# EAGLE design common_board_th (EAGLE 6.5.0)
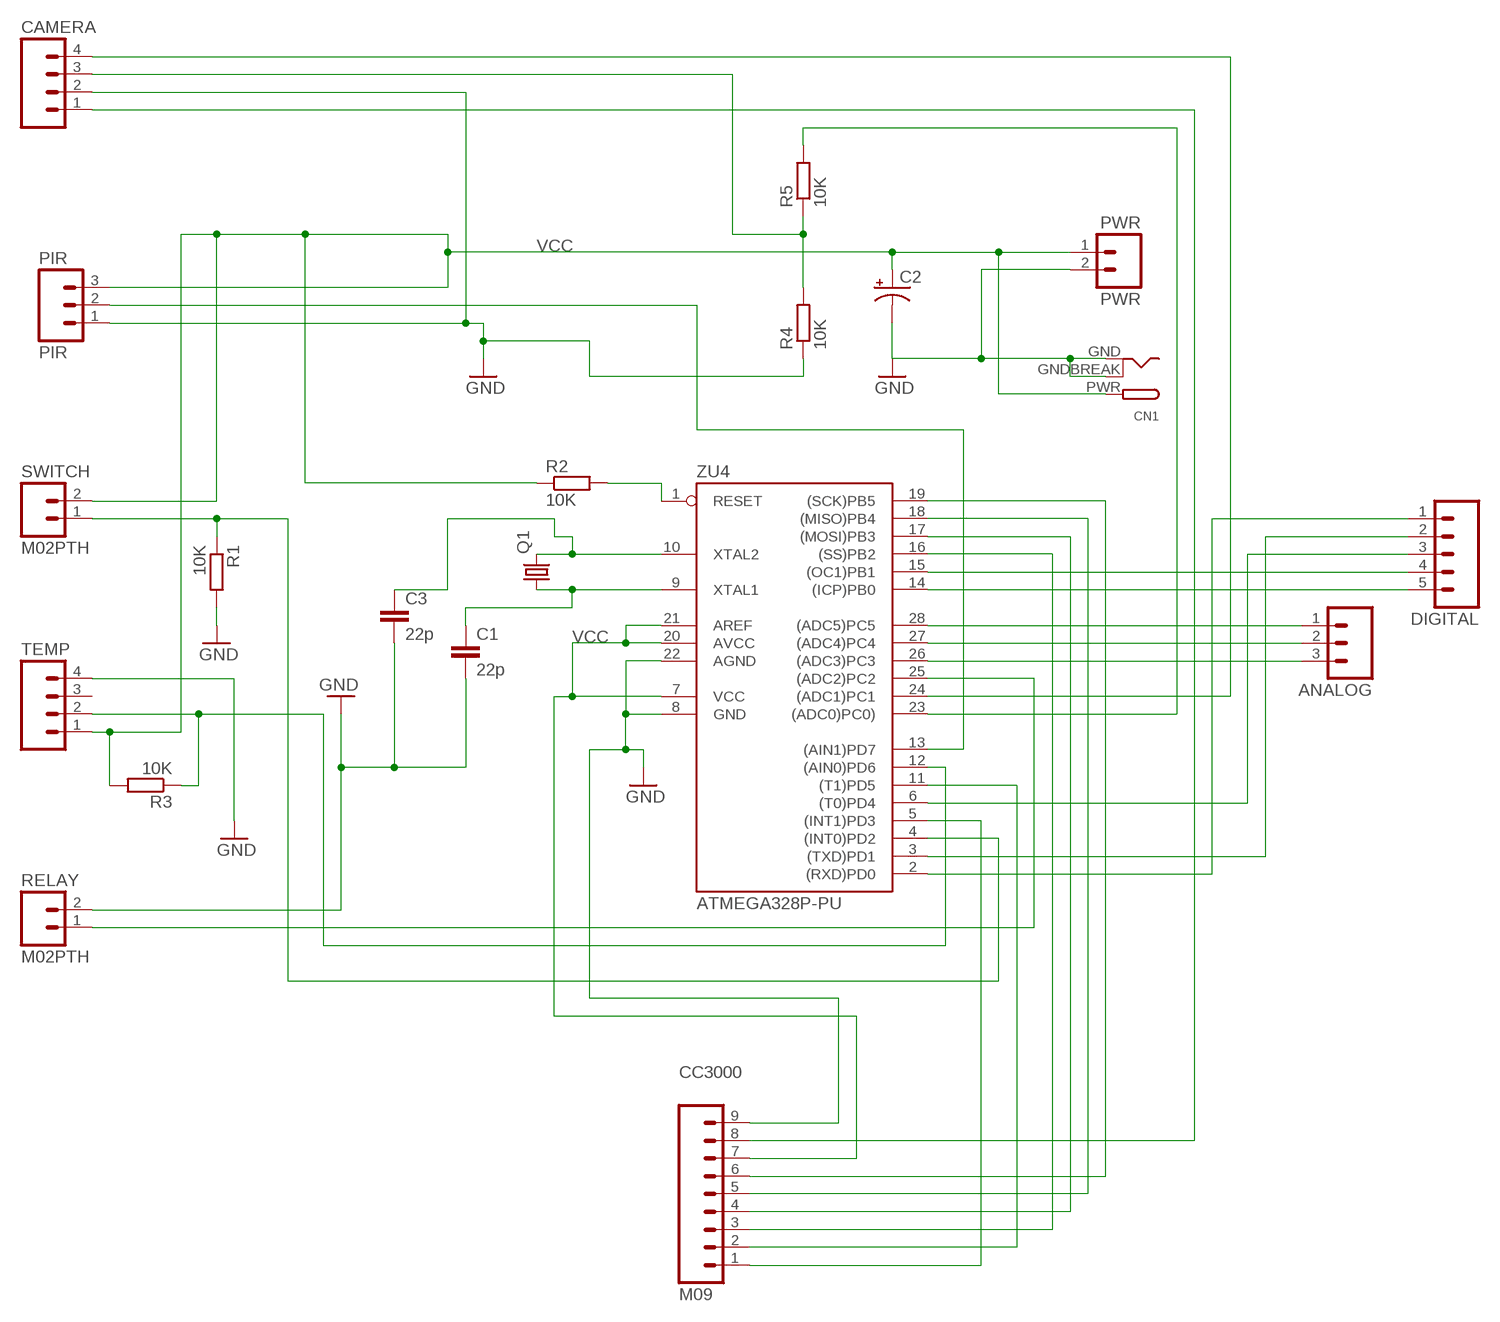
[diagram p0: schematic, sheet 1]

## Parts
ANALOG  M03PTH  [1X03]
C1  22p  C-EU050-025X075  [C050-025X075]
C2  CAP_POLPTH1  [CPOL-RADIAL-100UF-25V]
C3  22p  C-EU050-025X075  [C050-025X075]
CAMERA  M04PTH  [1X04]
CC3000  M09  [1X09]
CN1  DCBARRELPTH  [DCJACK_2MM_PTH]
DIGITAL  M05PTH  [1X05]
PIR  PIR  M03PTH  [1X03]
PWR  PWR  M02PTH  [1X02]
Q1  CRYSTALHC49S  [HC49/S]
R1  10K  R-EU_0207/7  [0207/7]
R2  10K  R-EU_0207/7  [0207/7]
R3  10K  R-EU_0207/7  [0207/7]
R4  10K  R-EU_0207/7  [0207/7]
R5  10K  R-EU_0207/7  [0207/7]
RELAY  M02PTH  [1X02]
SWITCH  M02PTH  [1X02]
TEMP  M04PTH  [1X04]
ZU4  ATMEGA328P-PU  [DIL28-3]

## Nets
GND [gnd]: C1.2 C2.2(-) C3.2 CAMERA.2 CC3000.9 CN1.GND CN1.GNDBREAK PIR.1 PWR.2 R1.2 R4.1 RELAY.2 TEMP.4 ZU4.8(GND) ZU4.22(AGND)
N$1: CC3000.2 ZU4.11((T1)PD5)
N$2: CC3000.1 ZU4.5((INT1)PD3)
N$3: R2.2 ZU4.1(RESET)
N$4: C1.1 Q1.1 ZU4.9(XTAL1)
N$5: CC3000.6 ZU4.19((SCK)PB5)
N$6: CC3000.3 ZU4.16((SS)PB2)
N$7: R1.1 SWITCH.1 ZU4.4((INT0)PD2)
N$8: RELAY.1 ZU4.25((ADC2)PC2)
N$9: R3.1 TEMP.2 ZU4.12((AIN0)PD6)
N$10: ANALOG.1 ZU4.28((ADC5)PC5)
N$11: CAMERA.1 CC3000.8
N$12: CAMERA.4 ZU4.24((ADC1)PC1)
N$13: CAMERA.3 R4.2 R5.1
N$14: ANALOG.2 ZU4.27((ADC4)PC4)
N$15: R5.2 ZU4.23((ADC0)PC0))
N$16: ANALOG.3 ZU4.26((ADC3)PC3)
N$17: DIGITAL.4 ZU4.15((OC1)PB1)
N$18: DIGITAL.5 ZU4.14((ICP)PB0)
N$19: CC3000.5 ZU4.18((MISO)PB4)
N$20: CC3000.4 ZU4.17((MOSI)PB3)
N$21: DIGITAL.3 ZU4.6((T0)PD4)
N$22: DIGITAL.2 ZU4.3((TXD)PD1)
N$23: DIGITAL.1 ZU4.2((RXD)PD0)
N$26: PIR.2 ZU4.13((AIN1)PD7)
VCC [usbvcc]: C2.1(+) CC3000.7 CN1.PWR PIR.3 PWR.1 R2.1 R3.2 SWITCH.2 TEMP.1 ZU4.7(VCC) ZU4.20(AVCC) ZU4.21(AREF)
XTAL2: C3.1 Q1.2 ZU4.10(XTAL2)
Unconnected: TEMP.3

## Library data of the parts
ANALOG PIR = SparkFun-Connectors:M03: Header 3 Standard 3-pin 0.1" header. Use with straight break away headers (SKU : PRT-00116), right angle break away headers (PRT-00553), swiss pins (PRT-00743), machine pins (PRT-00117), and female headers (PRT-00115). Molex polarized connector foot print use with SKU : PRT-08232 with associated crimp pins and housings.
C1 C3 = resistor:C-EU: CAPACITOR, European symbol
C2 = SparkFun-Passives:CAP_POL: Capacitor Polarized These are standard SMD and PTH capacitors. Normally 10uF, 47uF, and 100uF in electrolytic and tantalum varieties. Always verify the external diameter of the through hole cap, it varies with capacity, voltage, and manufacturer. The EIA devices should be standard.
CAMERA TEMP = SparkFun-Connectors:M04: Header 4 Standard 4-pin 0.1" header. Use with straight break away headers (SKU : PRT-00116), right angle break away headers (PRT-00553), swiss pins (PRT-00743), machine pins (PRT-00117), and female headers (PRT-00115). Molex polarized connector foot print use with SKU : PRT-08231 with associated crimp pins and housings. 1MM SMD Version SKU: PRT-10208
CC3000 = SparkFun-Connectors:M09: Header 9 Standard 9-pin 0.1" header. Use with straight break away headers (SKU : PRT-00116), right angle break away headers (PRT-00553), swiss pins (PRT-00743), machine pins (PRT-00117), and female headers (PRT-00115).
CN1 = adafruit:DCBARREL: 2.0mm DC Barrel Jack DCJACK_2MM_PTH - Through Hole Jack (4UConnector: 05537)
DIGITAL = SparkFun-Connectors:M05: Header 5 Standard 5-pin 0.1" header. Use with straight break away headers (SKU : PRT-00116), right angle break away headers (PRT-00553), swiss pins (PRT-00743), machine pins (PRT-00117), and female headers (PRT-00115). Molex polarized connector foot print use with SKU : PRT-08230 with associated crimp pins and housings.
PWR RELAY SWITCH = SparkFun-Connectors:M02: Standard 2-pin 0.1" header. Use with - straight break away headers ( PRT-00116) - right angle break away headers (PRT-00553) - swiss pins (PRT-00743) - machine pins (PRT-00117) - female headers (PRT-00115) Molex polarized connector foot print use with: PRT-08233 with associated crimp pins and housings. 2.54_SCREWTERM for use with PRT-10571. 3.5mm Screw Terminal footprints for PRT-08084 5mm Screw Terminal footprints for use with PRT-08433
Q1 = crystal:CRYSTAL: CRYSTAL; OC_FARNELL: 1667008; OC_NEWARK: unknown
R1-R5 = resistor:R-EU_: RESISTOR, European symbol
ZU4 = SmartPrj:ATMEGA328P-: MICROCONTROLLER 4 Kbytes FLASH 128 bytes SRAM 256 bytes EEPROM UART 6-channel 10 bit ADC

## Net classes
0 default: width 0.152 mm, clearance 0.152 mm
1 power: width 0.61 mm, drill 0.61 mm, clearance 0.254 mm
2 gnd: width 0.203 mm, drill 0.559 mm, clearance 0.152 mm
3 usbvcc: width 0.203 mm, drill 0.61 mm, clearance 0.152 mm
4 aref: width 0.406 mm, drill 0.61 mm, clearance 0.254 mm

## Board
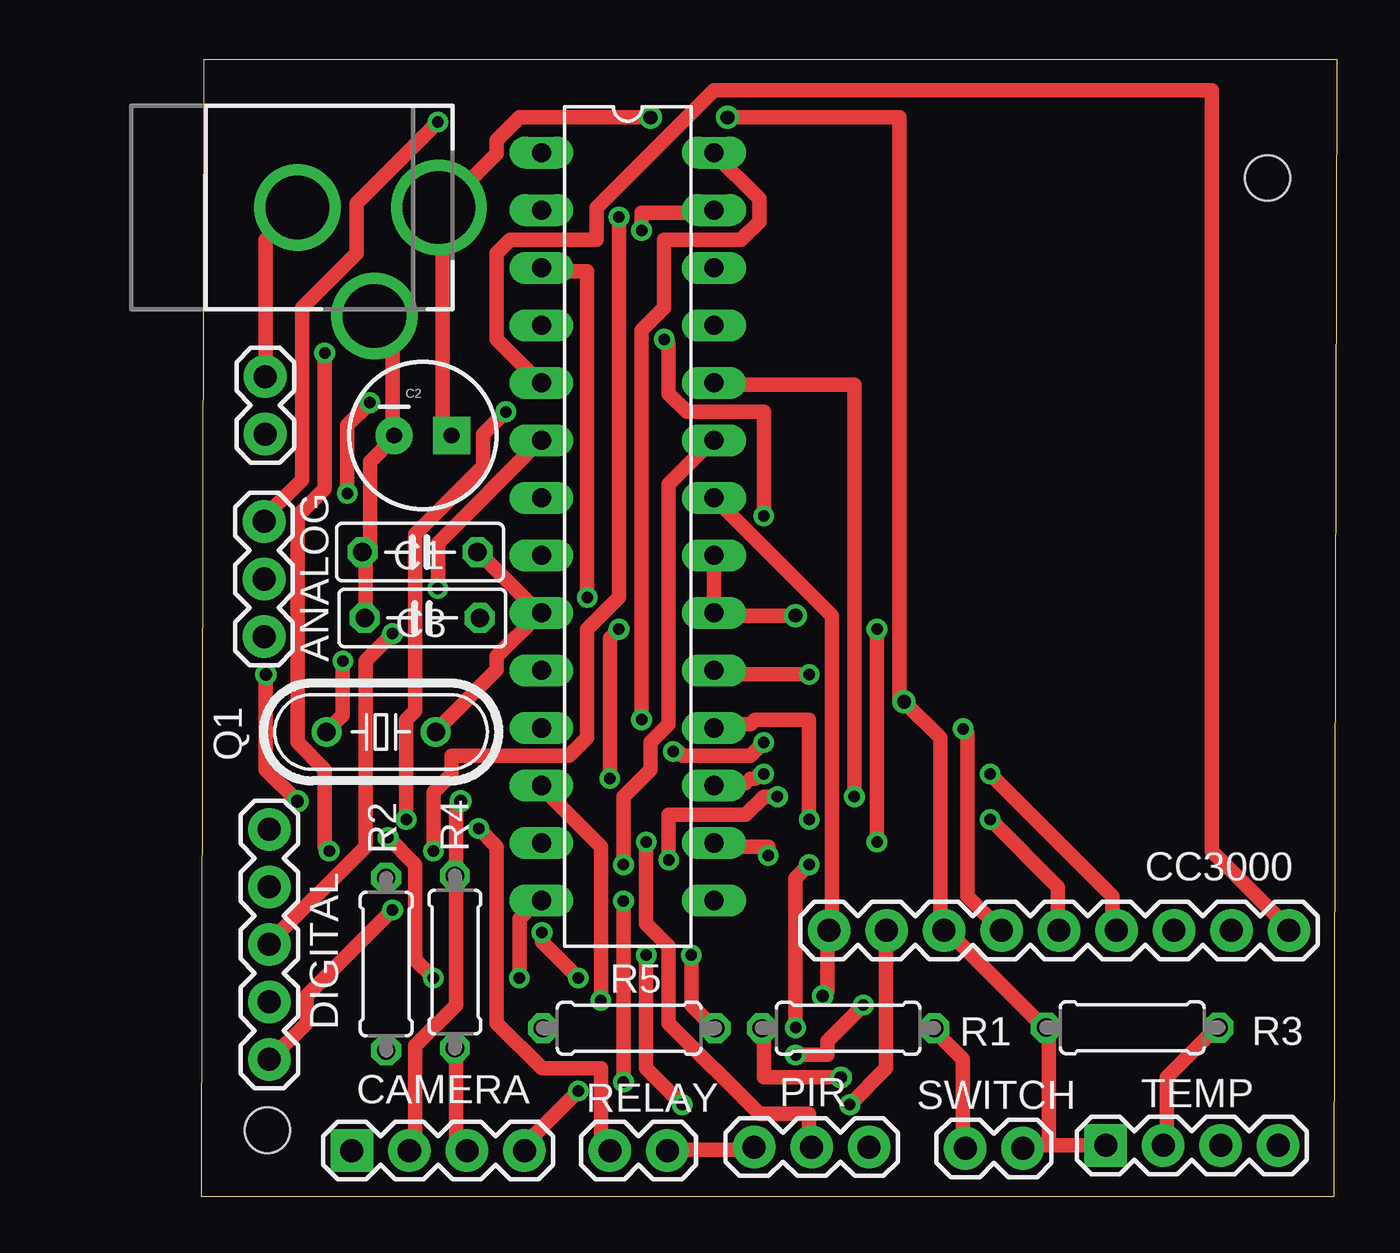
[diagram p1: board, top side]
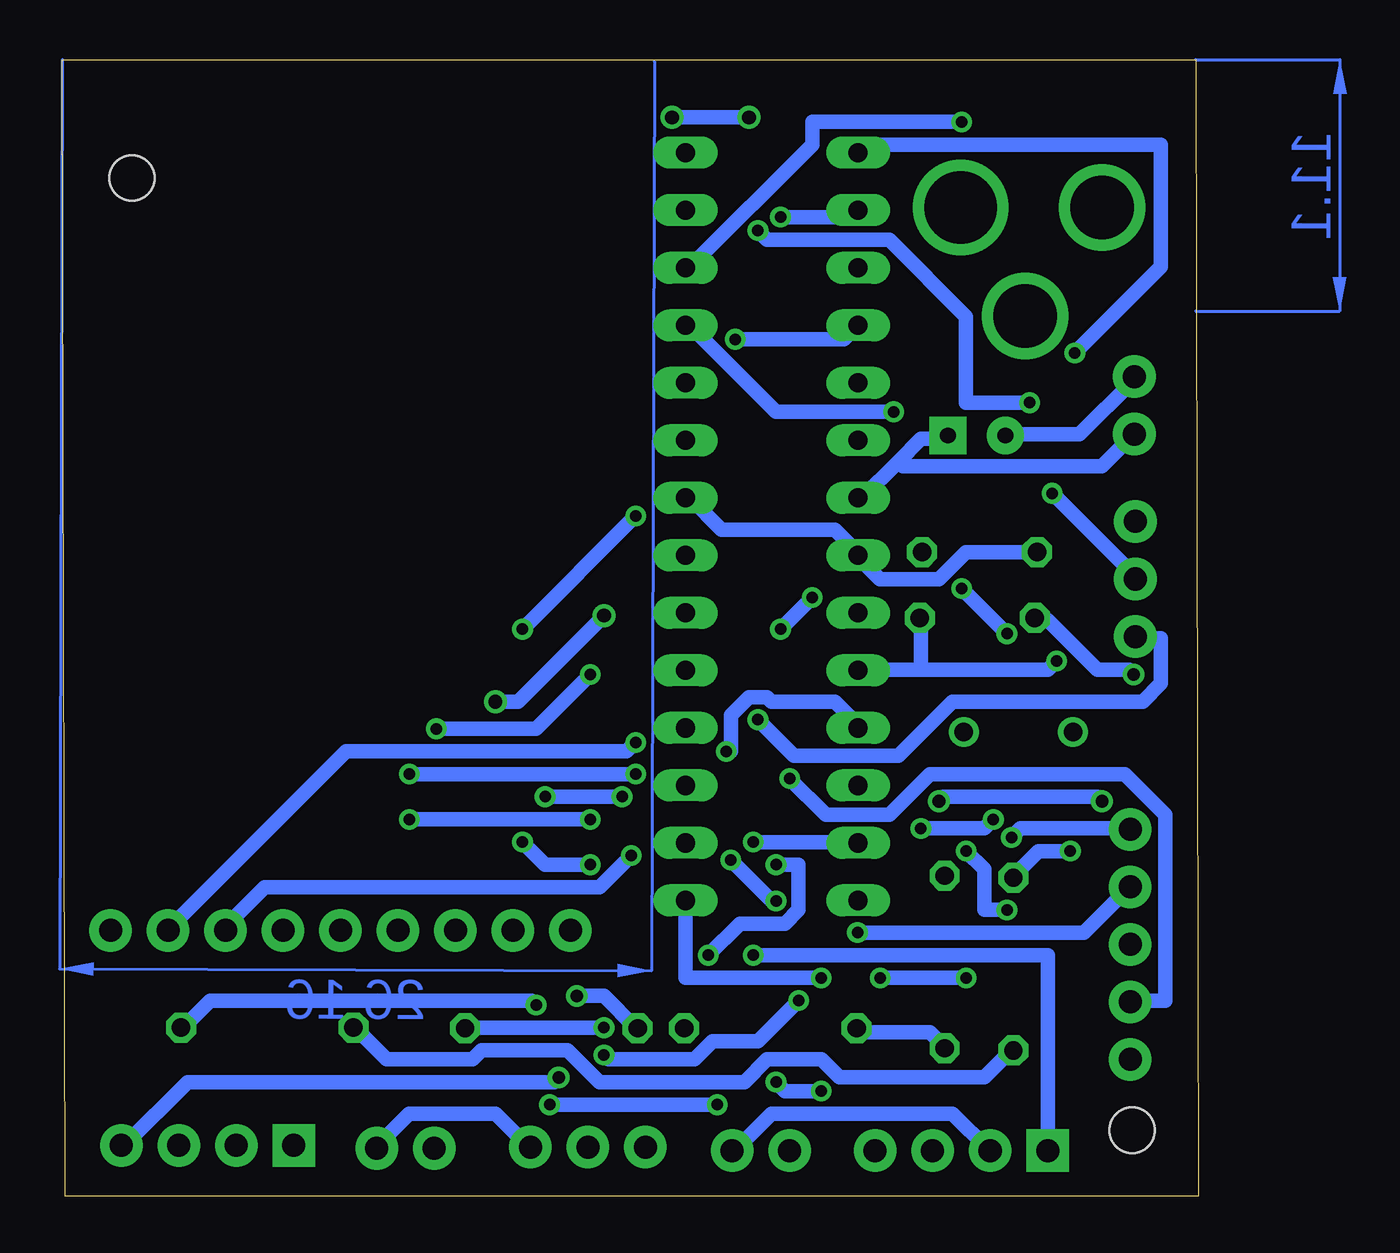
[diagram p2: board, bottom side, seen from below]

Size 50.2 x 50.2 mm. Coordinates in mm from the lower left corner, seen from the top.
Outline: 0,0 50.07,0 50.2,50.2 0.12,50.2 0,0
Copper layers (1*16): Top 0.035mm / dielectric 1.5mm / Bottom 0.035mm
Design rules "default *": minimum track width 25mil, minimum drill 20mil, track to track 10mil, track to pad 8mil, pad to pad 8mil, via to via 8mil, smd to smd 8mil, copper to edge 40mil, drill to drill 8mil, minimum pad ring 10mil, minimum via ring 8mil, stop-mask expansion 4mil, vias tented up to drill 0mil, thermal gap 10mil
Holes 2 mm at 47.12,44.97 2.94,2.91

### Footprints (pad centres in the part's own frame; a part is rotated, then mirrored left to right if it is on the bottom)
1X03 = drill 1.016 pad 1.88: 1 0,0; 2 2.54,0; 3 5.08,0
C050-025X075 = drill 0.813 octagon: 1 -2.54,0; 2 2.54,0
CPOL-RADIAL-100UF-25V = drill 0.7 pad 1.651 square: 1 1.27,0 | drill 0.7 pad 1.651: 2 -1.27,0
1X04 = drill 1.016 pad 1.88 square: 1 0,0 | drill 1.016 pad 1.88: 2 2.54,0; 3 5.08,0; 4 7.62,0
1X09 = drill 1.016 pad 1.88: 1 0,0; 2 2.54,0; 3 5.08,0; 4 7.62,0; 5 10.16,0; 6 12.7,0; 7 15.24,0; 8 17.78,0; 9 20.32,0
DCJACK_2MM_PTH = drill 2.8: GND 0,7.35; GNDBREAK 4.8,10.75 | drill 3.2: PWR 0,13.6
1X05 = drill 1.016 pad 1.88: 1 0,0; 2 2.54,0; 3 5.08,0; 4 7.62,0; 5 10.16,0
1X02 = drill 1.016 pad 1.88: 1 0,0; 2 2.54,0
HC49/S = drill 0.813: 1 -2.413,0; 2 2.413,0
0207/7 = drill 0.813 octagon: 1 -3.81,0; 2 3.81,0
DIL28-3 = drill 0.85 pad 1.422 long: 1 -16.51,-3.81; 2 -13.97,-3.81; 3 -11.43,-3.81; 4 -8.89,-3.81; 5 -6.35,-3.81; 6 -3.81,-3.81; 7 -1.27,-3.81; 8 1.27,-3.81; 9 3.81,-3.81; 10 6.35,-3.81; 11 8.89,-3.81; 12 11.43,-3.81; 13 13.97,-3.81; 14 16.51,-3.81; 15 16.51,3.81; 16 13.97,3.81; 17 11.43,3.81; 18 8.89,3.81; 19 6.35,3.81; 20 3.81,3.81; 21 1.27,3.81; 22 -1.27,3.81; 23 -3.81,3.81; 24 -6.35,3.81; 25 -8.89,3.81; 26 -11.43,3.81; 27 -13.97,3.81; 28 -16.51,3.81

### Placement (x,y rotation side)
ANALOG  2.79,24.71 90 top
C1  9.68,28.45 180 top
C2  9.8,33.59 0 top
C3  9.78,25.53 180 top
CAMERA  6.67,2.02 0 top
CC3000  48.06,11.73 180 top
CN1  -3.08,43.66 270 top
DIGITAL  3.02,6.04 90 top
PIR  24.43,2.16 0 top
PWR  2.83,33.66 90 top
Q1  7.96,20.5 180 top
R1  28.59,7.41 180 top
R2  8.18,10.25 90 top
R3  41.14,7.44 180 top
R4  11.21,10.34 270 top
R5  18.91,7.41 0 top
RELAY  18.07,2.02 0 top
SWITCH  33.77,2.12 0 top
TEMP  39.96,2.24 0 top
ZU4  18.85,29.57 270 top

### Tracks (layer width: path | path; a pad name or v marks a point on that pad's centre or on a via)
GND  (via drill 0.56)
  Top 0.635: v27.46,8.84 27.66,9.04 27.66,11.64 CC3000.9 27.86,12.04 27.86,25.64 ZU4.22 | v28.27,5.24 24.86,5.24 24.86,7.24 R1.2 | RELAY.2 20.66,2.04 24.27,2.04 PIR.1 | CAMERA.2 9.27,2.04 9.46,2.24 9.46,6.64 11.27,8.44 11.27,14.04 R4.1 11.27,14.44 11.27,17.24 v11.46,17.44 | 4.27,43.84 CN1.GND 4.06,43.44 2.87,42.24 2.87,36.24 PWR.2 | C3.2 7.26,25.64 7.26,28.44 C1.2 7.46,28.64 7.46,32.44 8.46,33.44 C2.2 8.46,33.84 8.46,38.04 7.67,38.84 CN1.GNDBREAK | v4.27,17.44 2.87,18.84 v2.87,23.04
  Bottom 0.635: v27.46,8.84 26.27,8.84 24.86,7.44 R1.2 | v28.27,5.24 28.46,5.04 44.66,5.04 47.46,2.24 TEMP.4 | RELAY.2 20.46,2.04 18.86,3.64 10.86,3.64 9.27,2.04 CAMERA.2 | ZU4.22 22.46,30.84 21.06,29.44 16.07,29.44 15.07,28.44 ZU4.8 14.86,28.04 14.07,27.24 11.46,27.24 10.27,28.44 7.26,28.44 C1.2 | PWR.2 2.87,36.04 5.27,33.64 8.46,33.64 C2.2 | v11.46,17.44 11.27,17.64 4.46,17.64 v4.27,17.44 | v2.87,23.04 3.06,23.24 4.46,23.24 6.67,25.44 7.07,25.44 C3.2
N$1  (via drill 0.51)
  Top 0.635: v20.86,19.64 21.06,19.64 21.27,19.44 24.27,19.44 v24.86,20.04
  Bottom 0.635: v20.86,19.64 20.66,19.64 20.66,21.24 19.86,22.04 19.06,22.04 18.86,21.84 16.07,21.84 15.07,20.84 ZU4.11 | v24.86,20.04 25.27,19.64 37.66,19.64 45.46,11.84 CC3000.2
N$2
  Top 0.635: ZU4.5 14.86,36.04 13.07,37.84 13.07,41.64 13.66,42.24 17.46,42.24 17.46,43.64 22.66,48.84 44.66,48.84 44.66,15.24 48.06,11.84 CC3000.1
N$3  (via drill 0.51)
  Top 0.635: v5.67,15.24 5.46,15.44 5.46,18.84 4.27,20.04 4.27,30.04 5.46,31.24 v5.46,37.24
  Bottom 0.635: v5.67,15.24 7.07,15.24 8.07,14.24 R2.2 | v5.46,37.24 1.67,41.04 1.67,46.44 14.66,46.44 14.86,46.24 ZU4.1
N$4
  Top 0.635: Q1.1 10.46,20.64 13.07,23.24 13.07,23.84 14.86,25.64 ZU4.9 14.66,25.84 14.66,26.04 12.27,28.44 C1.1
N$5  (via drill 0.51)
  Top 0.635: v26.86,23.04 22.66,23.04 ZU4.19 | v33.66,20.64 33.87,20.44 33.87,13.24 35.27,11.84 CC3000.6
  Bottom 0.635: v26.86,23.04 29.27,20.64 v33.66,20.64
N$6  (via drill 0.51)
  Top 0.635: v25.06,15.04 25.06,15.44 22.66,15.44 ZU4.16
  Bottom 0.635: v25.06,15.04 26.46,13.64 41.27,13.64 43.06,11.84 CC3000.3
N$7  (via drill 0.51)
  Top 0.635: R1.1 32.47,7.24 33.66,6.04 33.66,2.24 SWITCH.1 | v20.46,37.84 20.66,37.64 20.66,35.44 21.46,34.64 24.86,34.64 v24.86,30.04 | v29.86,15.64 v29.86,25.04 | v26.86,14.64 26.27,14.04 v26.27,7.44
  Bottom 0.635: v20.46,37.84 15.66,37.84 15.07,38.44 ZU4.4 | v29.86,25.04 v24.86,30.04 | v29.86,15.64 28.86,14.64 v26.86,14.64 | v26.27,7.44 32.27,7.44 R1.1
N$8  (via drill 0.51)
  Top 0.635: v13.46,34.64 12.46,33.64 12.46,32.24 9.46,29.24 9.46,21.44 9.07,21.04 v9.07,16.64 | v12.27,16.24 13.07,15.44 13.07,7.64 15.07,5.64 17.66,5.64 17.66,2.44 18.07,2.04 RELAY.1
  Bottom 0.635: v13.46,34.64 18.66,34.64 22.46,38.44 ZU4.25 | v9.07,16.64 9.46,16.24 v12.27,16.24
N$9  (via drill 0.51)
  Top 0.635: R3.1 44.87,7.44 42.66,5.24 42.66,2.24 TEMP.2 | v17.66,8.64 17.66,15.44 15.07,18.04 ZU4.12 | v26.27,6.24 27.66,6.24 27.66,6.84 v29.27,8.44
  Bottom 0.635: v17.66,8.64 19.46,6.84 21.46,6.84 22.27,6.04 26.06,6.04 v26.27,6.24 | v29.27,8.44 29.46,8.64 43.66,8.64 44.87,7.44 R3.1
N$10  (via drill 0.51)
  Top 0.635: v19.46,21.04 19.46,38.24 20.46,39.24 20.46,42.24 23.86,42.24 24.66,43.04 24.66,44.04 22.66,46.04 ZU4.28
  Bottom 0.635: v19.46,21.04 17.86,19.44 13.27,19.44 10.86,21.84 2.46,21.84 1.67,22.64 1.67,24.64 2.67,24.64 ANALOG.1
N$11  (via drill 0.51)
  Top 0.635: v19.66,10.64 19.66,5.64 v21.27,4.04 | v28.66,4.04 30.27,5.64 30.27,11.64 CC3000.8
  Bottom 0.635: CAMERA.1 6.67,10.64 v19.66,10.64 | v28.66,4.04 v21.27,4.04
N$12  (via drill 0.51)
  Top 0.635: v28.86,17.64 28.86,35.84 22.66,35.84 ZU4.24 | v25.46,17.64 24.86,17.64 24.06,16.84 20.66,16.84 v20.66,14.84 | v18.66,5.04 v18.66,13.04 | v16.66,4.64 14.46,2.44 14.46,2.04 CAMERA.4
  Bottom 0.635: v25.46,17.64 v28.86,17.64 | v20.66,14.84 18.86,13.04 v18.66,13.04 | v18.66,5.04 18.27,4.64 v16.66,4.64
N$13
  Top 0.635: CAMERA.3 11.66,2.04 11.27,2.44 11.27,6.44 R4.2
  Bottom 0.635: R4.2 11.27,6.64 11.86,7.24 15.07,7.24 R5.1
N$14  (via drill 0.51)
  Top 0.635: v19.46,42.64 19.46,43.44 22.46,43.44 ZU4.27 | v7.46,35.04 6.46,34.04 v6.46,31.04
  Bottom 0.635: v19.46,42.64 19.06,42.24 13.66,42.24 10.27,38.84 10.27,35.04 v7.46,35.04 | v6.46,31.04 2.87,27.44 ANALOG.2
N$15  (via drill 0.51)
  Top 0.635: v21.66,10.64 21.66,8.44 22.66,7.44 R5.2 | v18.66,14.64 18.66,17.64 19.86,18.84 19.86,20.04 20.66,20.84 20.66,31.44 22.46,33.24 ZU4.23
  Bottom 0.635: v21.66,10.64 20.27,12.04 18.27,12.04 17.66,12.64 17.66,14.64 v18.66,14.64
N$16  (via drill 0.51)
  Top 0.635: v10.46,47.44 6.87,43.84 6.87,41.64 4.46,39.24 4.46,31.64 2.87,30.04 2.87,29.84 ANALOG.3
  Bottom 0.635: v10.46,47.44 17.07,47.44 17.07,46.44 22.46,41.04 ZU4.26
N$17  (via drill 0.51)
  Top 0.635: v16.66,9.64 15.07,11.24 v15.07,11.64
  Bottom 0.635: v16.66,9.64 22.66,9.64 22.66,13.04 ZU4.15 | v15.07,11.64 5.06,11.64 3.06,13.64 DIGITAL.4
N$18  (via drill 0.51)
  Top 0.635: v14.07,9.64 14.07,12.24 14.86,13.04 ZU4.14 | v10.27,9.64 9.46,10.44 9.46,14.64 v8.27,15.84
  Bottom 0.635: v10.27,9.64 v14.07,9.64 | v8.27,15.84 7.87,16.24 3.06,16.24 DIGITAL.5
N$19  (via drill 0.51)
  Top 0.635: v26.86,16.64 26.86,21.04 24.46,21.04 24.27,20.84 22.66,20.84 ZU4.18 | v34.87,16.64 37.87,13.64 37.87,11.84 CC3000.5
  Bottom 0.635: v34.87,16.64 v26.86,16.64
N$20  (via drill 0.51)
  Top 0.635: v24.86,18.64 24.66,18.64 24.46,18.44 24.27,18.44 24.06,18.24 22.66,18.24 ZU4.17 | v34.87,18.64 40.27,13.24 40.27,11.84 CC3000.4
  Bottom 0.635: v34.87,18.64 v24.86,18.64
N$21  (via drill 0.51)
  Top 0.635: v10.46,26.84 10.46,28.84 14.86,33.24 ZU4.6 | v8.46,24.84 7.26,23.64 7.26,15.44 3.06,11.24 DIGITAL.3
  Bottom 0.635: v8.46,24.84 v10.46,26.84
N$22  (via drill 0.51)
  Top 0.635: v17.07,26.44 17.07,40.84 15.07,40.84 ZU4.3 | v18.46,25.04 18.07,24.64 v18.07,18.44
  Bottom 0.635: v18.46,25.04 v17.07,26.44 | v18.07,18.44 16.46,16.84 13.66,16.84 11.86,18.64 3.27,18.64 1.47,16.84 1.47,8.64 2.87,8.64 DIGITAL.2
N$23  (via drill 0.51)
  Top 0.635: v18.46,43.24 18.46,26.44 17.07,25.04 17.07,20.24 16.27,19.44 11.07,19.44 11.07,18.64 10.27,17.84 v10.27,15.24 | v8.46,12.64 4.67,8.84 4.67,7.64 3.06,6.04 DIGITAL.1
  Bottom 0.635: v18.46,43.24 15.27,43.24 15.07,43.44 ZU4.2 | v10.27,15.24 9.46,14.44 9.46,12.64 v8.46,12.64
N$26  (via drill 0.51)
  Top 0.635: v19.66,15.64 19.66,12.04 20.66,11.04 20.66,7.64 24.66,3.64 26.86,3.64 26.86,2.24 PIR.2
  Bottom 0.635: v19.66,15.64 15.07,15.64 ZU4.13
VCC  (via drill 0.61)
  Top 0.635: C2.1 11.07,33.64 10.66,34.04 10.66,43.64 CN1.PWR 10.86,43.84 13.07,46.04 13.07,46.64 14.07,47.64 v19.86,47.64 | ZU4.21 22.66,28.24 22.66,25.84 ZU4.20 22.86,25.64 v26.27,25.64 | TEMP.1 37.46,2.24 | 37.46,2.24 36.46,2.24 SWITCH.2 | 37.46,2.24 37.46,7.44 R3.2 37.06,7.44 37.06,7.64 33.06,11.64 CC3000.7 32.66,11.84 32.66,20.24 v31.06,21.84 30.86,22.04 30.86,47.64 v23.27,47.64
  Bottom 0.635: 13.27,32.44 12.27,33.44 11.27,33.44 C2.1 | 13.27,32.44 14.86,30.84 ZU4.7 | PWR.1 2.87,33.64 4.27,32.24 13.07,32.24 13.27,32.44 | v26.27,25.64 30.06,21.84 v31.06,21.84 | PIR.3 29.66,2.24 31.06,3.64 34.87,3.64 36.27,2.24 SWITCH.2 | R2.1 8.27,6.44 9.46,5.24 15.86,5.24 16.66,6.04 19.06,6.04 20.06,5.04 26.46,5.04 27.86,6.44 31.66,6.44 32.06,6.04 35.87,6.04 37.27,7.44 R3.2 | v23.27,47.64 v19.86,47.64
XTAL2  (via drill 0.51)
  Top 0.635: v6.27,23.64 6.27,21.24 5.67,20.64 Q1.2
  Bottom 0.635: v6.27,23.64 6.67,23.24 12.27,23.24 | 12.27,23.24 14.86,23.24 ZU4.10 | 12.27,23.24 12.27,25.44 C3.1
(copper drawn outside any net)
  shapes: Bottom area x2